# Altium schematic sheet AquaMate.SchDoc
size A; SheetNumber: 1; SheetTotal: 1
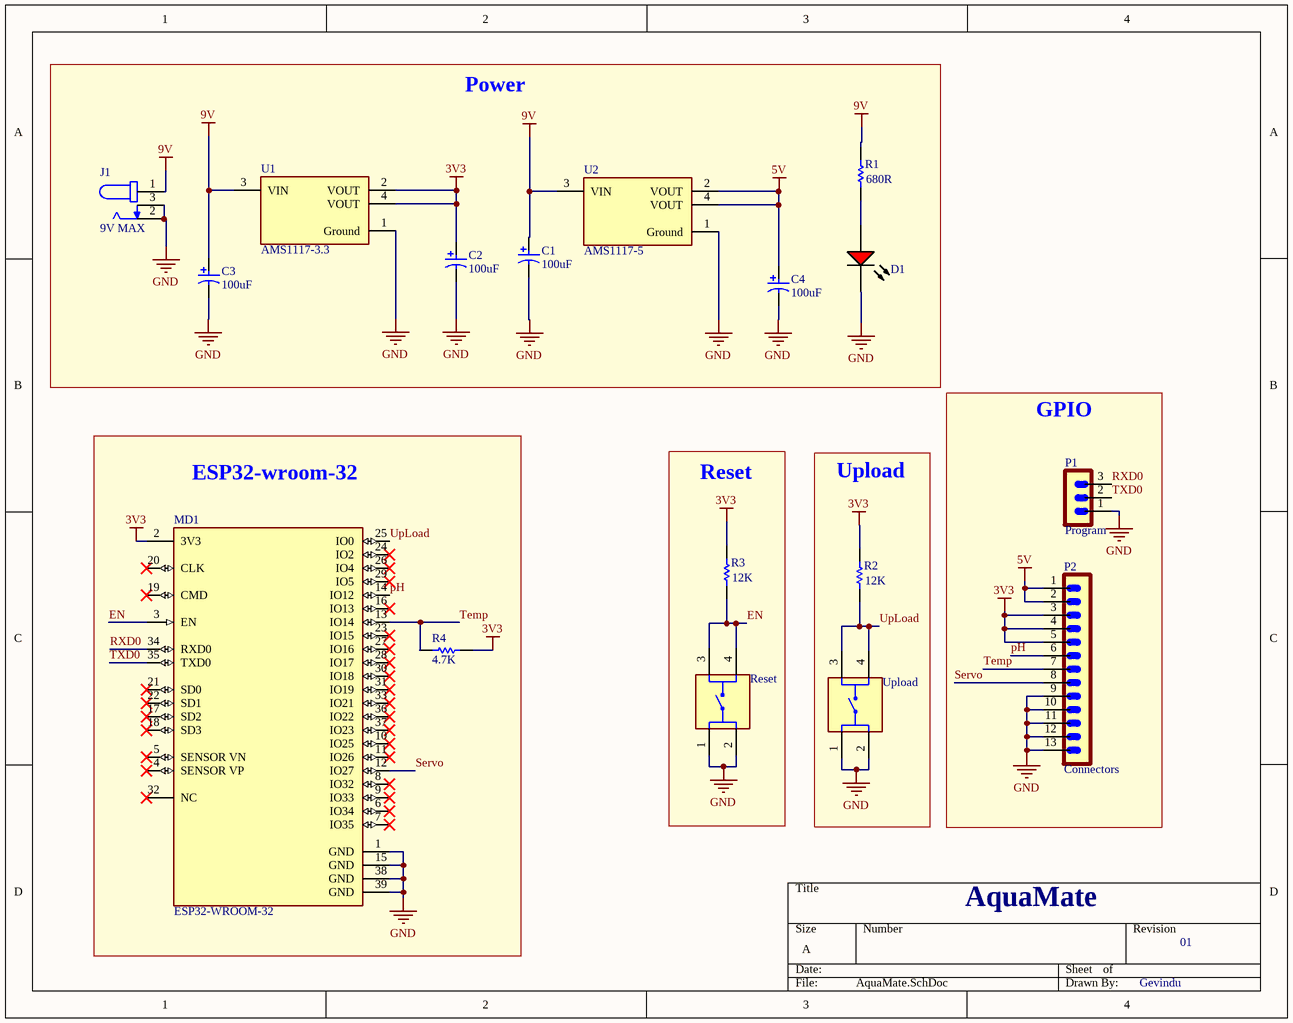
[diagram p0: AquaMate.SchDoc]

## Parts
C1  Capacitance: 100uF  [CAPPR65-350-1150X800X1250]  (hidden comment: ECA1HM101)
C2  Capacitance: 100uF  [CAPPR65-350-1150X800X1250]  (hidden comment: ECA1HM101)
C3  Capacitance: 100uF  [CAPPR65-350-1150X800X1250]  (hidden comment: ECA1HM101)
C4  Capacitance: 100uF  [CAPPR65-350-1150X800X1250]  (hidden comment: ECA1HM101)
D1  WP7113SRD/D  [KING-WP7113SRDD_V]  (value not drawn)
J1  9V MAX  [CUI_PJ-102A]
MD1  ESP32-WROOM-32  [FP-ESP32-WROOM-32-MFG]
P1  Program  [B3B-PH-K]
P2  Connectors  [B13B-PH-K]
R1  value 680R  [AXIAL-0.3]  (hidden comment: Res1)
R2  value 12K  [AXIAL-0.3]  (hidden comment: Res1)
R3  value 12K  [AXIAL-0.3]  (hidden comment: Res1)
R4  value 4.7K  [AXIAL-0.3]  (hidden comment: Res1)
Reset  1825910-6  [SW_1825910-6-4]  (value not drawn)
U1  AMS1117-3.3  [FP-AMS1117-IPC_C]
U2  AMS1117-5  [FP-AMS1117-IPC_C]
Upload  1825910-6  [SW_1825910-6-4]  (value not drawn)

## Blocks framed on the sheet
Power: C1-C4 D1 J1 R1 U1 U2
GPIO: P1 P2
ESP32-wroom-32: MD1 R4
Reset: R3 Reset
Upload: R2 Upload

## Nets
3V3: C2.1 MD1.2(3V3) P2.3 P2.4 P2.5 R2.2 R3.2 R4.1 U1.2(VOUT) U1.4(VOUT)
5V: C4.1 P2.1 P2.2 U2.2(VOUT) U2.4(VOUT)
9V: C1.1 C3.1 J1.1 R1.2 U1.3(VIN) U2.3(VIN)
GND: C1.2 C2.2 C3.2 C4.2 D1.2(K) J1.2 J1.3 MD1.1(GND) MD1.15(GND) MD1.38(GND) MD1.39(GND) P1.1 P2.9 P2.10 P2.11 P2.12 P2.13 Reset.1 Reset.2 U1.1(Ground) U2.1(Ground) Upload.1 Upload.2
EN: MD1.3(EN) R3.1 Reset.3 Reset.4
pH: MD1.14(IO12) P2.6
RXD0: MD1.34(RXD0) P1.3
Servo: MD1.12(IO27) P2.8
Temp: MD1.13(IO14) P2.7 R4.2
TXD0: MD1.35(TXD0) P1.2
UpLoad: MD1.25(IO0) R2.1 Upload.3 Upload.4
NetD1_1: D1.1(A) R1.1

Not connected (* = marked no-connect by the designer): MD1 4(SENSOR_VP)* 5(SENSOR_VN)* 6(IO34)* 7(IO35)* 8(IO32)* 9(IO33)* 10(IO25)* 11(IO26)* 16(IO13)* 17(SD2)* 18(SD3)* 19(CMD)* 20(CLK)* 21(SD0)* 22(SD1)* 23(IO15)* 24(IO2)* 26(IO4)* 27(IO16)* 28(IO17)* 29(IO5)* 30(IO18)* 31(IO19)* 32(NC)* 33(IO21)* 36(IO22)* 37(IO23)*

## Notes on the sheet
- AquaMate
- 01
- Gevindu

## Library data of the parts
C1-C4 = CMP-1665-00042-2: Aluminum Electrolytic Capacitor, 100 uF, +/- 20%, 50 V, -40 to 85 degC, 2-Pin THD, RoHS, Bulk; Manufacturer: Panasonic; Lead Diameter: 0.6mm; Dielectric Material: Aluminium; Voltage Rating (DC): 50V; Ripple Current (AC): 250mA; Polarity: Polar; Leakage Current: 3uA; Life (Hours): 2000Hour; Lead/Base Style: Straight; Dissipation Factor: 0.12%; Radiation Hardening: No; Height: 11.5mm; Package Quantity: 200; Package Reference: CAPPR65-350-1150X800X1250; Min Operating Temperature: -40degC; Mount: ThroughHole; Package Description: 2-Pin Radial Lead, Dia 8 mm, Height 12.5 mm; Case/Package: Radial; Diameter: 8mm; Voltage Rating: 50V; Length: 11.5mm; REACH SVHC: NoSVHC; Height - Seated (Max): 0.492inch; Datasheet URL: https://industrial.panasonic.com/cdbs/www-data/pdf/RDF0000/ABA0000C1218.pdf; RoHSCompliant: true; Ripple Current: 250mA; Lead Free: LeadFree; Voltage: 50V; Manufacturer URL: http://www.panasonic.com/; Number of Pins: 2; Datasheet Version: Rev. 05, 10/2016; Packaging: Bulk; Termination: Radial; Max Operating Temperature: 85degC; Tolerance: 20%; Lead Pitch: 3.5mm
D1 = CMP-1757-00002-1: The Super Bright Red Source Color Device, 1.85 V, -40 to 85 degC, 2-Pin THD, RoHS, Tape and Reel; Density: 1 MB; Min Supply Voltage: 1.71 V; Max Clock Frequency: 120 MHz; Max Supply Voltage: 3.6 V; Interface: UART; RAM Size: 128 KB; Case\Package: LQFP; Max Operating Temperature: 105 degC; Weight: 0.012224 oz; REACH SVHC: No SVHC; DatasheetVersion: Rev. 6A, 07/2016; Package Quantity: 160; Packaging: Tray; ComponentLink1Description: Datasheet; Min Operating Temperature: -40 degC; PackageDescription: 2-Pin Through Hole Device, Dia 5.9 mm, Body Length 8.6 mm; Pins: 64; PackageReference: WP7113SRDD; ComponentLink1URL: http://www.kingbrightusa.com/images/catalog/SPEC/WP7113SRD-D.pdf; RoHSCompliant: true
J1 = PJ-102A: 2.0 mm Center Pin, 2.5 A, Right Angle, Through Hole, Tapered Pins, Dc Power Jack Connector; Package: None; Price: None; Value: *; MP: PJ-102A; Availability: Unavailable
MD1 = CMP-194065-000008-1: RX TXRX MOD WIFI SURFACE MOUNT; Frequency: 2.5GHz; Sensitivity: -98dBm; Operating Supply Voltage: 3.6V; Data Rate: 150Mbps; Weight: 0.088185oz; Package Quantity: 550; Min Operating Temperature: -40°C; Mount: Surface Mount; Max Operating Temperature: 85°C; Packaging: Cut Tape; Case/Package: SMD/SMT
P1 = B3B-PH-K: Connector Header Through Hole 3 position 0.079 (2.00mm); MF: JST; Package: None; Value: *; MP: B3B-PH-K; Price: None; SnapEDA_Link: https://www.snapeda.com/parts/B3B-PH-K/JST/view-part/2895696/?ref=snap; Check_prices: https://www.snapeda.com/parts/B3B-PH-K/JST/view-part/2895696/?ref=eda; Availability: No availability data
P2 = B13B-PH-K: Connector Header Through Hole 13 position 0.079 (2.00mm); MF: JST; Purchase-URL: https://pricing.snapeda.com/search/part/B13B-PH-K/?ref=eda; Package: None; Value: *; Price: None; MP: B13B-PH-K; Availability: In Stock
R1-R4 = Res1: Resistor; Published: 8-Jun-2000; LatestRevisionDate: 17-Jul-2002; LatestRevisionNote: Re-released for DXP Platform.; PackageReference: AXIAL-0.3; Publisher: Altium Limited; PackageDescription: Axial Device, Thru-Hole; 2 Leads; 0.3 in Pin Spacing
Reset Upload = 1825910-6: Switch Tactile OFF (ON) SPST Round Button PC Pins 0.05A 24VDC 100000Cycles 1.57N Thru-Hole Loose; Package: None; MP: 1825910-6; Value: *; Price: None; Availability: Unavailable
U1 = CMP-209535-000001-1: LDO Voltage Regulators 1A, 3.3V; Manufacturer: Advanced Monolithic Systems; Dropout Voltage: 1.1V; Output Type: Fixed; Nominal Supply Current: 5mA; Max Power Dissipation: 1.2W; Max Supply Voltage: 15V; Number Of Outputs: 1; Standoff Height: 0.64mm; Max Junction Temp: +125°C; Height: 1.8mm; Package: AMS1117; Device Class L2: Power Management ICs; ComponentLink2Description: Datasheet; ComponentLink2URL: http://www.advanced-monolithic.com/pdf/ds1117.pdf; Category: IC; RoHS: TRUE; Automotive: No; Device Class L1: Integrated Circuits (ICs); Output Current: 1A; Device Class L3: Voltage Regulators - Linear; Temperature: -40°C to +125°C; Output Voltage: 3.3V; Manufacturer Part Number: AMS1117-3.3; Temperature Range Low: -40°C; Octopart: https://octopart.com/ams1117-3.3-advanced+monolithic+systems-25899300; Lead Free: Yes; Ipc Land Pattern Name: SOT229P700X180-4; Temperature Range High: +125°C
U2 = CMP-209535-000001-1: LDO Voltage Regulators 1A, 5V; Manufacturer Part Number: AMS1117-3.3; Manufacturer: Advanced Monolithic Systems; Dropout Voltage: 1.1V; Output Type: Fixed; Nominal Supply Current: 5mA; Max Power Dissipation: 1.2W; Max Supply Voltage: 15V; Number Of Outputs: 1; Standoff Height: 0.64mm; Max Junction Temp: +125°C; Height: 1.8mm; Package: AMS1117; Device Class L2: Power Management ICs; ComponentLink2Description: Datasheet; ComponentLink2URL: http://www.advanced-monolithic.com/pdf/ds1117.pdf; Category: IC; RoHS: TRUE; Automotive: No; Device Class L1: Integrated Circuits (ICs); Output Current: 1A; Device Class L3: Voltage Regulators - Linear; Temperature: -40°C to +125°C; Output Voltage: 5V; Temperature Range Low: -40°C; Octopart: https://octopart.com/ams1117-3.3-advanced+monolithic+systems-25899300; Lead Free: Yes; Ipc Land Pattern Name: SOT229P700X180-4; Temperature Range High: +125°C